# Altium project MeshVines_Router_Battery.PrjPcb
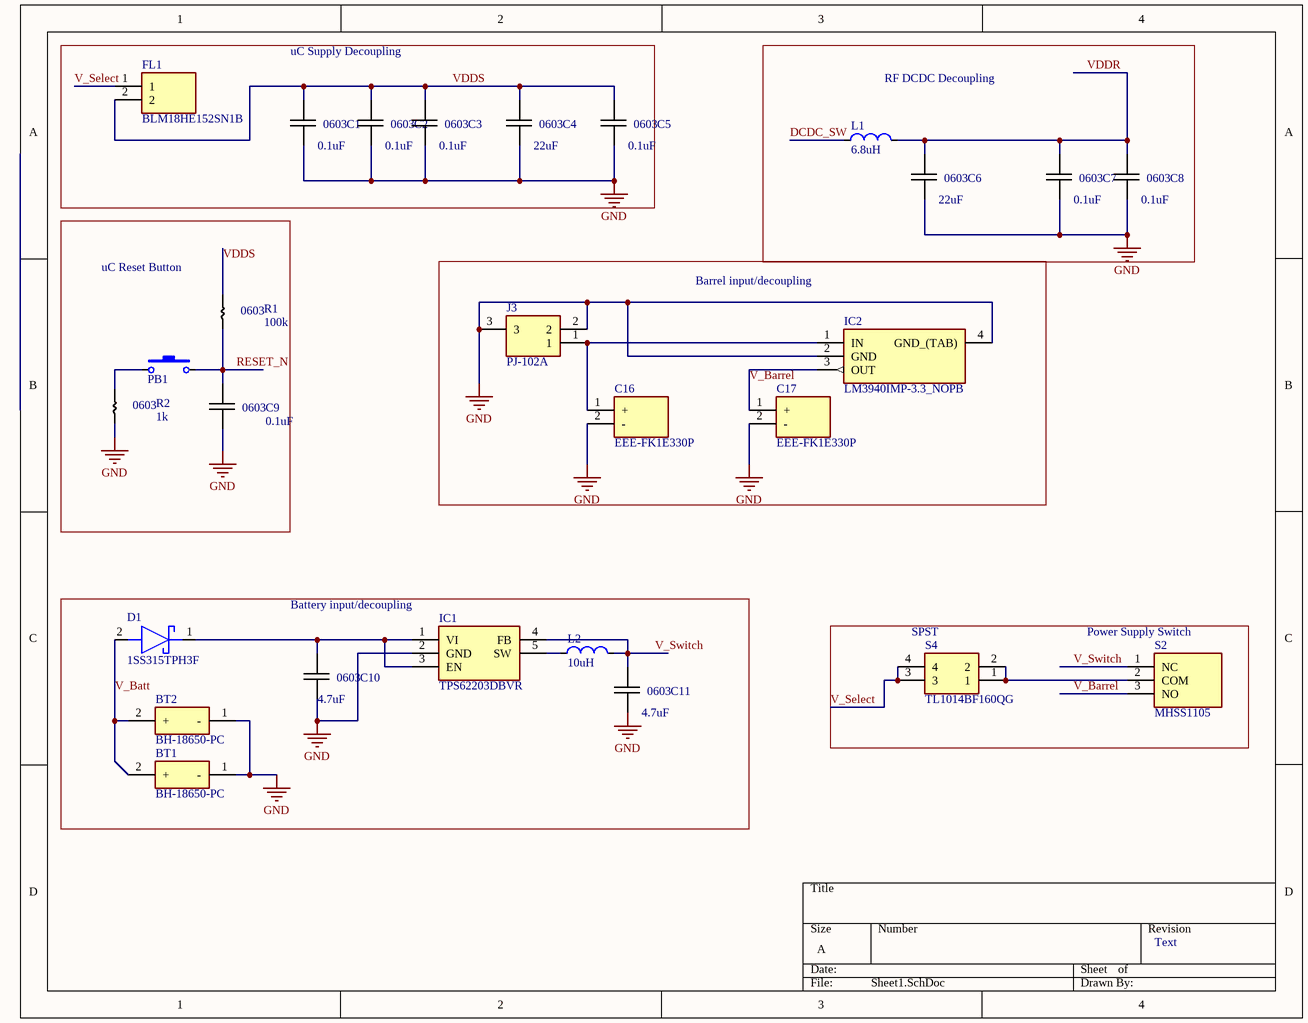
[diagram p0: Sheet1.SchDoc]
3 sheets, 52 parts. Net scope: global (net labels, ports and power ports of the same name join across sheets).
Board file: V3.PcbDoc
Sheets:
  Sheet1.SchDoc
  Sheet2.SchDoc
  Sheet3.SchDoc

## Sheet Sheet1.SchDoc
size A

### Parts
BT1  BH-18650-PC  [BH18650PC]
BT2  BH-18650-PC  [BH18650PC]
C1  0.1uF  [0603_SMD]
C2  0.1uF  [0603_SMD]
C3  0.1uF  [0603_SMD]
C4  22uF  [0603_SMD]
C5  0.1uF  [0603_SMD]
C6  22uF  [0603_SMD]
C7  0.1uF  [0603_SMD]
C8  0.1uF  [0603_SMD]
C9  0.1uF  [0603_SMD]
C10  4.7uF  [0603_SMD]
C11  4.7uF  [0603_SMD]
C16  EEE-FK1E330P  [CAPAE660X610N]
C17  EEE-FK1E330P  [CAPAE660X610N]
D1  1SS315TPH3F  [SOD2513X110N]
FL1  BLM18HE152SN1B  [BEADC1608X95N]
IC1  TPS62203DBVR  [SOT95P280X145-5N]
IC2  LM3940IMP-3.3_NOPB  [SOT230P700X180-4N]
J3  PJ-102A  [PJ-102AH]
L1  value 6.8uH  [PASSIVE-INDUCTOR-0603]  (hidden comment: Passive-Inductor (Generic))
L2  value 10uH  [PASSIVE-INDUCTOR-0603]  (hidden comment: Passive-Inductor (Generic))
PB1  Interface-Push-Button  [INTERFACE-PUSH-BUTTON]  (value not drawn)
R1  100k  [0603_SMD]
R2  1k  [0603_SMD]
S2  MHSS1105  [MHSS1105]
S4  TL1014BF160QG  [TL1014BF160QG]

### Blocks framed on the sheet
uC Supply Decoupling: C1-C5 FL1
RF DCDC Decoupling: C6-C8 L1
uC Reset Button: C9 PB1 R1 R2
Barrel input/decoupling: C16 C17 IC2 J3
Battery input/decoupling: BT1 BT2 C10 C11 D1 IC1 L2

### Nets
GND: BT1.1(-) BT2.1(-) C1.1 C2.1 C3.1 C4.1 C5.1 C6.1 C7.1 C8.1 C9.1 C10.1 C11.1 C16.2(-) C17.2(-) IC1.2(GND) IC2.2(GND) IC2.4(GND_(TAB)) J3.2 J3.3 R2.2
DCDC_SW: L1.1
RESET_N: C9.2 PB1.2 R1.2
V_Barrel: C17.1(+) IC2.3(OUT) S2.3(NO)
V_Batt: BT1.2(+) BT2.2(+) D1.2(A)
V_Select: FL1.1 S4.3 S4.4
V_Switch: C11.2 IC1.4(FB) L2.2 S2.1(NC)
VDDR: C6.2 C7.2 C8.2 L1.2
VDDS: C1.2 C2.2 C3.2 C4.2 C5.2 FL1.2 R1.1
NetC10_2: C10.2 D1.1(K) IC1.1(VI) IC1.3(EN)
NetC16_1: C16.1(+) IC2.1(IN) J3.1
NetIC1_5: IC1.5(SW) L2.1
NetPB1_1: PB1.1 R2.1
NetS2_2: S2.2(COM) S4.1 S4.2

### Notes on the sheet
- (near S4) SPST
- (near S2) Power Supply Switch
- Text
- (in symbol C_0603) 0603
- (in symbol R_0603) 0603

### Library data of the parts
BT1 BT2 = BH-18650-PC: Battery; Manufacturer_Name: MPD (Memory Protection Devices); Datasheet Link: http://www.memoryprotectiondevices.com/datasheets/BH-18650-PC-datasheet.pdf; Height: 21.31mm; Manufacturer_Part_Number: BH-18650-PC
C1-C11 = C_0603
C16 C17 = EEE-FK1E330P: Capacitor Polarised; Manufacturer_Name: Panasonic; Allied_Number: 70258257; Datasheet Link: https://industrial.panasonic.com/cdbs/www-data/pdf/RDE0000/ABA0000C1181.pdf; Height: 6.1mm; Manufacturer_Part_Number: EEE-FK1E330P; Mouser Part Number: 667-EEE-FK1E330P; Mouser Price/Stock: https://www.mouser.com/Search/Refine.aspx?Keyword=667-EEE-FK1E330P; Allied Price/Stock: https://www.alliedelec.com/panasonic-eee-fk1e330p/70258257/
D1 = 1SS315TPH3F: Schottky Diode; Manufacturer_Name: Toshiba; Datasheet Link: http://toshiba.semicon-storage.com/info/docget.jsp?did=2666&prodName=1SS315; Height: 1.1mm; Manufacturer_Part_Number: 1SS315TPH3F; Mouser Part Number: 757-1SS315TPH3F; Mouser Price/Stock: https://www.mouser.com/Search/Refine.aspx?Keyword=757-1SS315TPH3F
FL1 = BLM18HE152SN1B: Filter; Manufacturer_Name: Murata Electronics; Datasheet Link: https://www.murata.com/en-us/products/productdetail?partno=BLM18HE152SN1%23; Height: 0.95mm; Manufacturer_Part_Number: BLM18HE152SN1B; Mouser Part Number: N/A; Mouser Price/Stock: https://www.mouser.com/Search/Refine.aspx?Keyword=N%2FA
IC1 = TPS62203DBVR: Integrated Circuit; Manufacturer_Name: Texas Instruments; Datasheet Link: http://www.ti.com/lit/ds/symlink/tps62203.pdf; Height: 1.45mm; Manufacturer_Part_Number: TPS62203DBVR; Mouser Part Number: 595-TPS62203DBVR; Mouser Price/Stock: https://www.mouser.com/Search/Refine.aspx?Keyword=595-TPS62203DBVR
IC2 = LM3940IMP-3.3_NOPB: Integrated Circuit; Manufacturer_Name: Texas Instruments; Manufacturer_Part_Number: LM3940IMP-3.3/NOPB; Datasheet Link: http://www.ti.com/lit/ds/symlink/lm3940.pdf; Height: 1.8mm; Mouser Part Number: 926-LM3940IMP3.3NOPB; Mouser Price/Stock: https://www.mouser.com/Search/Refine.aspx?Keyword=926-LM3940IMP3.3NOPB; RS Part Number: 5361546P; RS Price/Stock: http://uk.rs-online.com/web/p/products/5361546P
J3 = PJ-102A: Connector; Manufacturer_Name: CUI; Datasheet Link: https://www.cui.com/product/resource/pj-102a.pdf; Manufacturer_Part_Number: PJ-102A; Mouser Part Number: 490-PJ-102A; Mouser Price/Stock: https://www.mouser.com/Search/Refine.aspx?Keyword=490-PJ-102A
L1 L2 = Passive-Inductor (Generic): Generic Inductor; Category: Passive; Manufacturer: *; Supplier 2: Digi-Key; Manufacturer Part Number: *; Supplier 1: Mouser; Package: *; Supplier Part Number 1: *; Supplier Part Number 2: *; Through Hole (y/n): *
PB1 = Interface-Push-Button: 2.5mm Tall, 2.5N Force, Straight, SMD, Push Button; Manufacturer: C&K Components; Manufacturer Part Number: PTS820 J25K SMTR LFS; Value: Single; Through Hole (y/n): N; ComponentLink1Description: Datasheet; ComponentLink1URL: https://www.mouser.com/datasheet/2/60/pts820-1382642.pdf; Category: Interface; Package: SMD-6; Supplier 1: Mouser; Supplier Part Number 1: 611-PTS820J25KSMTR; Supplier 2: Digi-Key; Supplier Part Number 2: CKN10897CT-ND
R1 R2 = R_0603
S2 = MHSS1105: Switch; Manufacturer_Name: Apem; Datasheet Link: https://componentsearchengine.com/Datasheets/2/MHSS1105.pdf; Height: 4mm; Manufacturer_Part_Number: MHSS1105; Mouser Part Number: 642-MHSS1105; Mouser Price/Stock: https://www.mouser.com/Search/Refine.aspx?Keyword=642-MHSS1105
S4 = TL1014BF160QG: Switch; Manufacturer_Name: E-Switch; Datasheet Link: https://www.e-switch.com/system/asset/product_line/data_sheet/141/TL1014.pdf; Height: 1mm; Manufacturer_Part_Number: TL1014BF160QG; Mouser Part Number: 612-TL1014BF160QG; Mouser Price/Stock: https://www.mouser.com/Search/Refine.aspx?Keyword=612-TL1014BF160QG

## Sheet Sheet2.SchDoc
size A
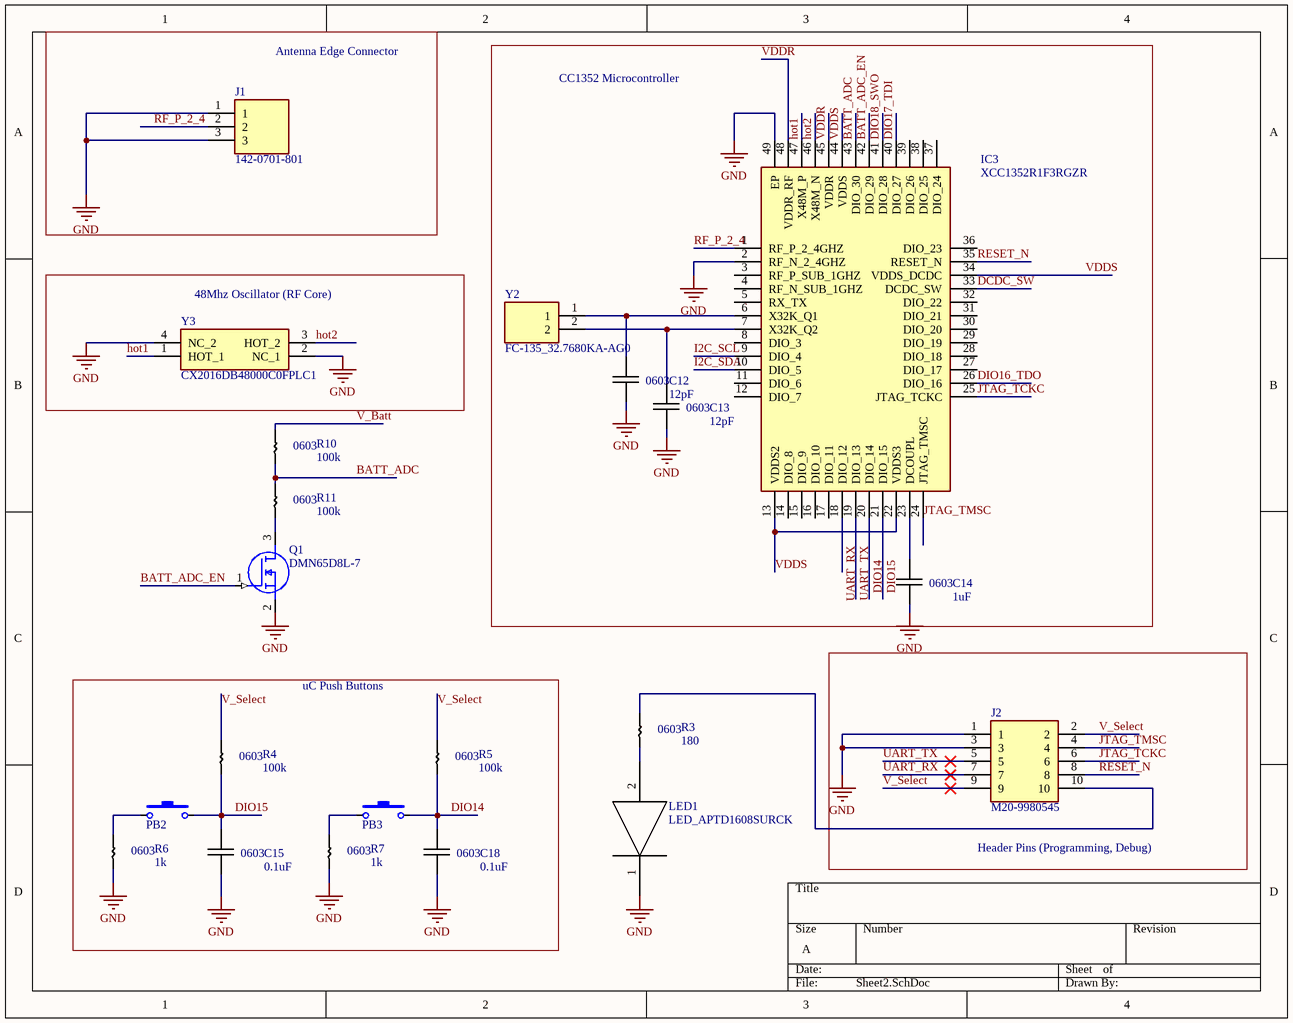
[diagram p1: Sheet2.SchDoc]

### Parts
C12  12pF  [0603_SMD]
C13  12pF  [0603_SMD]
C14  1uF  [0603_SMD]
C15  0.1uF  [0603_SMD]
C18  0.1uF  [0603_SMD]
IC3  XCC1352R1F3RGZR  [QFN50P700X700X100-49N-D]
J1  142-0701-801  [142-0701-851]
J2  M20-9980545  [HDRV10W80P254_2X5_1270X508X864P]
LED1  LED_APTD1608SURCK  [LED_APTD1608SURCK]
PB2  Interface-Push-Button  [INTERFACE-PUSH-BUTTON]  (value not drawn)
PB3  Interface-Push-Button  [INTERFACE-PUSH-BUTTON]  (value not drawn)
Q1  DMN65D8L-7  [SOT96P240X100-3N]
R3  180  [0603_SMD]
R4  100k  [0603_SMD]
R5  100k  [0603_SMD]
R6  1k  [0603_SMD]
R7  1k  [0603_SMD]
R10  100k  [0603_SMD]
R11  100k  [0603_SMD]
Y2  FC-135_32.7680KA-AG0  [FC135327680KAAG0]
Y3  CX2016DB48000C0FPLC1  [CX2016DB48000C0FPLC1]

### Blocks framed on the sheet
Antenna Edge Connector: J1
CC1352 Microcontroller: C12-C14 IC3 Y2
48Mhz Oscillator (RF Core): Y3
Header Pins (Programming, Debug): J2
uC Push Buttons: C15 C18 PB2 PB3 R4-R7

### Nets
GND: C12.1 C13.1 C14.1 C15.1 C18.1 IC3.2(RF_N_2_4GHZ) IC3.49(EP) J1.1 J1.3 J2.1 J2.3 LED1.1 Q1.2(S) R6.2 R7.2 Y3.2(NC_1) Y3.4(NC_2)
BATT_ADC: IC3.43(DIO_30) R10.2 R11.1
BATT_ADC_EN: IC3.42(DIO_29) Q1.1(G)
DCDC_SW: IC3.33(DCDC_SW)
DIO14: C18.2 IC3.20(DIO_14) PB3.2 R5.2
DIO15: C15.2 IC3.21(DIO_15) PB2.2 R4.2
DIO16_TDO: IC3.26(DIO_16)
DIO17_TDI: IC3.40(DIO_27)
DIO18_SWO: IC3.41(DIO_28)
hot1: IC3.47(X48M_P) Y3.1(HOT_1)
hot2: IC3.46(X48M_N) Y3.3(HOT_2)
I2C_SCL: IC3.9(DIO_4)
I2C_SDA: IC3.10(DIO_5)
JTAG_TCKC: IC3.25(JTAG_TCKC) J2.6
JTAG_TMSC: IC3.24(JTAG_TMSC) J2.4
RESET_N: IC3.35(RESET_N) J2.8
RF_P_2_4: IC3.1(RF_P_2_4GHZ) J1.2
UART_RX: IC3.18(DIO_12) J2.7
UART_TX: IC3.19(DIO_13) J2.5
V_Batt: R10.1
V_Select: J2.2 J2.9 R4.1 R5.1
VDDR: IC3.45(VDDR) IC3.48(VDDR_RF)
VDDS: IC3.13(VDDS2) IC3.22(VDDS3) IC3.34(VDDS_DCDC) IC3.44(VDDS)
NetC12_2: C12.2 IC3.6(X32K_Q1) Y2.1
NetC13_2: C13.2 IC3.7(X32K_Q2) Y2.2
NetC14_2: C14.2 IC3.23(DCOUPL)
NetJ2_10: J2.10 R3.1
NetLED1_2: LED1.2 R3.2
NetPB2_1: PB2.1 R6.1
NetPB3_1: PB3.1 R7.1
NetQ1_3: Q1.3(D) R11.2

Not connected (* = marked no-connect by the designer): IC3 3(RF_P_SUB_1GHZ) 4(RF_N_SUB_1GHZ) 5(RX_TX) 8(DIO_3) 11(DIO_6) 12(DIO_7) 14(DIO_8) 15(DIO_9) 16(DIO_10) 17(DIO_11) 27(DIO_17) 28(DIO_18) 29(DIO_19) 30(DIO_20) 31(DIO_21) 32(DIO_22) 36(DIO_23) 37(DIO_24) 38(DIO_25) 39(DIO_26)

### Notes on the sheet
- (in symbol C_0603) 0603
- (in symbol R_0603) 0603

### Library data of the parts
C12-C15 C18 = C_0603
IC3 = XCC1352R1F3RGZR: Integrated Circuit; Manufacturer_Name: Texas Instruments; Datasheet Link: http://www.ti.com/lit/gpn/cc1352r; Height: 1mm; Manufacturer_Part_Number: XCC1352R1F3RGZR
J1 = 142-0701-801: Connector; Manufacturer_Name: Cinch; Allied_Number: 70090267; Datasheet Link: http://www.farnell.com/datasheets/2048966.pdf; Manufacturer_Part_Number: 142-0701-801; Mouser Part Number: 530-142-0701-801; Mouser Price/Stock: https://www.mouser.com/Search/Refine.aspx?Keyword=530-142-0701-801; RS Part Number: 8861070; RS Price/Stock: http://uk.rs-online.com/web/p/products/8861070; Allied Price/Stock: https://www.alliedelec.com/johnson-cinch-connectivity-solutions-142-0701-801/70090267/
J2 = M20-9980545: Connector; Manufacturer_Name: HARWIN; Allied_Number: R1053034; Datasheet Link: https://componentsearchengine.com/Datasheets/2/M20-9980545.pdf; Height: 8.64mm; Manufacturer_Part_Number: M20-9980545; Mouser Part Number: 855-M20-9980545; Mouser Price/Stock: https://www.mouser.com/Search/Refine.aspx?Keyword=855-M20-9980545; RS Part Number: 6812950P; RS Price/Stock: http://uk.rs-online.com/web/p/products/6812950P; Allied Price/Stock: https://www.alliedelec.com/harwin-m20-9980545/R1053034/
PB2 PB3 = Interface-Push-Button: as PB1 on sheet Sheet1; ComponentLink1Description: Datasheet; ComponentLink1URL: https://www.mouser.com/datasheet/2/60/pts820-1382642.pdf; Category: Interface; Package: SMD-6; Supplier 1: Mouser; Supplier Part Number 1: 611-PTS820J25KSMTR; Supplier 2: Digi-Key; Supplier Part Number 2: CKN10897CT-ND
Q1 = DMN65D8L-7: MOSFET (N-Channel); Manufacturer_Name: Diodes Inc.; Allied_Number: 70550687; Datasheet Link: https://www.diodes.com/assets/Datasheets/DMN65D8L.pdf; Height: 1mm; Manufacturer_Part_Number: DMN65D8L-7; Mouser Part Number: 621-DMN65D8L-7; Mouser Price/Stock: https://www.mouser.com/Search/Refine.aspx?Keyword=621-DMN65D8L-7; RS Part Number: 8232952P; RS Price/Stock: http://uk.rs-online.com/web/p/products/8232952P; Allied Price/Stock: https://www.alliedelec.com/diodes-inc-dmn65d8l-7/70550687/
R3-R7 R10 R11 = R_0603
Y2 = FC-135_32.7680KA-AG0: Crystal or Oscillator; Manufacturer_Name: Epson Timing; Manufacturer_Part_Number: FC-135 32.7680KA-AG0; Datasheet Link: https://support.epson.biz/td/api/doc_check.php?dl=brief_FC-135&lang=en/.pdf; Height: 0mm; Mouser Part Number: 732-FC135-32.76KAAG0; Mouser Price/Stock: https://www.mouser.com/Search/Refine.aspx?Keyword=732-FC135-32.76KAAG0
Y3 = CX2016DB48000C0FPLC1: Crystal or Oscillator; Manufacturer_Name: Kyocera Electronic Components; Datasheet Link: https://componentsearchengine.com/Datasheets/1/CX2016DB48000C0FPLC1.pdf; Manufacturer_Part_Number: CX2016DB48000C0FPLC1; Mouser Part Number: 581-CX2016DB48CFPLC1; Mouser Price/Stock: https://www.mouser.com/Search/Refine.aspx?Keyword=581-CX2016DB48CFPLC1

## Sheet Sheet3.SchDoc
size A
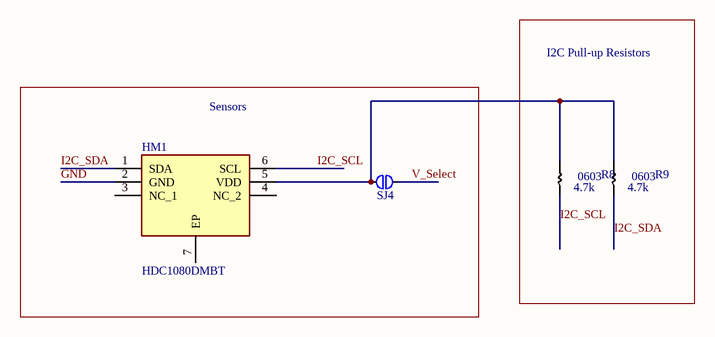
[diagram p2: Sheet3.SchDoc]

### Parts
HM1  HDC1080DMBT  [SON100P300X300X80-7N]
R8  4.7k  [0603_SMD]
R9  4.7k  [0603_SMD]
SJ4  Debug-Solder-Jumper  [DEBUG-SOLDER-JUMPER]  (value not drawn)  (no BOM)

### Blocks framed on the sheet
I2C Pull-up Resistors: R8 R9
Sensors: HM1 SJ4

### Nets
GND: HM1.2(GND)
I2C_SCL: HM1.6(SCL) R8.2
I2C_SDA: HM1.1(SDA) R9.2
V_Select: SJ4.2
NetHM1_5: HM1.5(VDD) R8.1 R9.1 SJ4.1

Not connected (* = marked no-connect by the designer): HM1 3(NC_1) 4(NC_2) 7(EP)

### Notes on the sheet
- (in symbol R_0603) 0603

### Library data of the parts
HM1 = HDC1080DMBT: Hygrometer; Manufacturer_Name: Texas Instruments; Datasheet Link: http://www.mouser.com/ds/2/405/hdc1080-844688.pdf; Height: 0.8mm; Manufacturer_Part_Number: HDC1080DMBT; Mouser Part Number: 595-HDC1080DMBT; Mouser Price/Stock: https://www.mouser.com/Search/Refine.aspx?Keyword=595-HDC1080DMBT; RS Part Number: 1330170P; RS Price/Stock: http://uk.rs-online.com/web/p/products/1330170P
R8 R9 = R_0603
SJ4 = Debug-Solder-Jumper: 3.5mm Diameter, Solder Jumper Pad; Category: Debug

## Nets that join several sheets
GND: Sheet1 (21 pins), Sheet2 (17 pins), Sheet3 (HM1.2)
DCDC_SW: Sheet1 (L1.1), Sheet2 (IC3.33)
I2C_SCL: Sheet2 (IC3.9), Sheet3 (HM1.6 R8.2)
I2C_SDA: Sheet2 (IC3.10), Sheet3 (HM1.1 R9.2)
RESET_N: Sheet1 (C9.2 PB1.2 R1.2), Sheet2 (IC3.35 J2.8)
V_Batt: Sheet1 (BT1.2 BT2.2 D1.2), Sheet2 (R10.1)
V_Select: Sheet1 (FL1.1 S4.3 S4.4), Sheet2 (J2.2 J2.9 R4.1 R5.1), Sheet3 (SJ4.2)
VDDR: Sheet1 (C6.2 C7.2 C8.2 L1.2), Sheet2 (IC3.45 IC3.48)
VDDS: Sheet1 (7 pins), Sheet2 (IC3.13 IC3.22 IC3.34 IC3.44)